# EAGLE design piezo-preamp-alex-rice-FETS v3 (EAGLE 7.2.0)
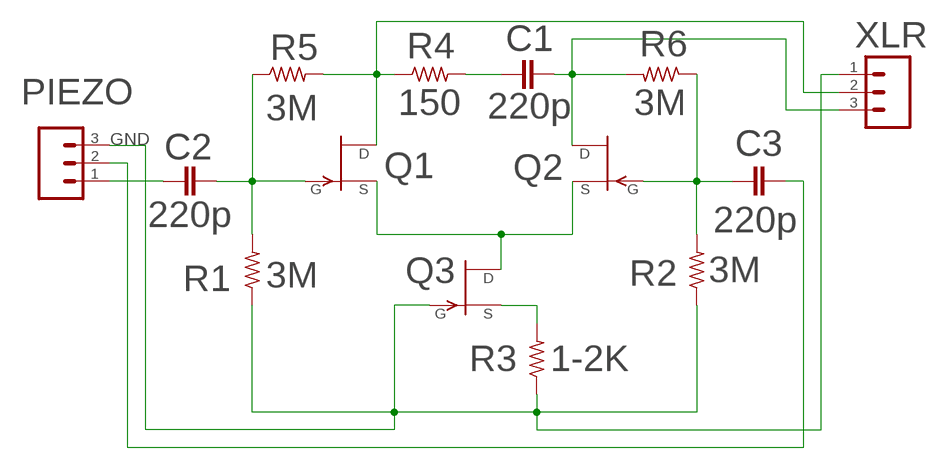
[diagram p0: schematic, sheet 1]

## Parts
C1  220p  C-EU050-030X075  [C050-030X075]
C2  220p  C-EU050-030X075  [C050-030X075]
C3  220p  C-EU050-030X075  [C050-030X075]
PIEZO  M03LOCK  [1X03_LOCK]
Q1  2N3819  2N3819-WIDETO92_WIDE  [TO92]
Q2  2N3819-WIDETO92_WIDE  [TO92]
Q3  2N3819-WIDETO92_WIDE  [TO92]
R1  3M  R-US_0204/5  [0204/5]
R2  3M  R-US_0204/5  [0204/5]
R3  1-2K  R-US_0204/5  [0204/5]
R4  150  R-US_0204/5  [0204/5]
R5  3M  R-US_0204/5  [0204/5]
R6  3M  R-US_0204/5  [0204/5]
XLR  M03LOCK  [1X03_LOCK]

## Nets
GND: PIEZO.3 Q3.2(G) R1.1 R2.1 R3.1 XLR.1
N$1: Q1.1(D) R4.1 R5.2 XLR.2
N$2: C1.2 Q2.1(D) R6.2 XLR.3
N$3: C1.1 R4.2
N$4: C3.1 Q2.2(G) R2.2 R6.1
N$5: C2.2 Q1.2(G) R1.2 R5.1
N$8: Q3.3(S) R3.2
N$10: C2.1 PIEZO.1
N$11: Q1.3(S) Q2.3(S) Q3.1(D)
N$12: C3.2 PIEZO.2

## Library data of the parts
C1-C3 = rcl:C-EU: CAPACITOR, European symbol
PIEZO = SparkFun-Connectors:M03: Header 3 Standard 3-pin 0.1" header. Use with straight break away headers (SKU : PRT-00116), right angle break away headers (PRT-00553), swiss pins (PRT-00743), machine pins (PRT-00117), and female headers (PRT-00115). Molex polarized connector foot print use with SKU : PRT-08232 with associated crimp pins and housings.; GND: GND
Q1-Q3 = T092_wide:2N3819-WIDE: N-Channel Junction FET
R1-R3 R5 R6 = rcl:R-US_: RESISTOR, American symbol
R4 = resistor:R-US_: RESISTOR, American symbol
XLR = SparkFun-Connectors:M03: Header 3 Standard 3-pin 0.1" header. Use with straight break away headers (SKU : PRT-00116), right angle break away headers (PRT-00553), swiss pins (PRT-00743), machine pins (PRT-00117), and female headers (PRT-00115). Molex polarized connector foot print use with SKU : PRT-08232 with associated crimp pins and housings.

## Board
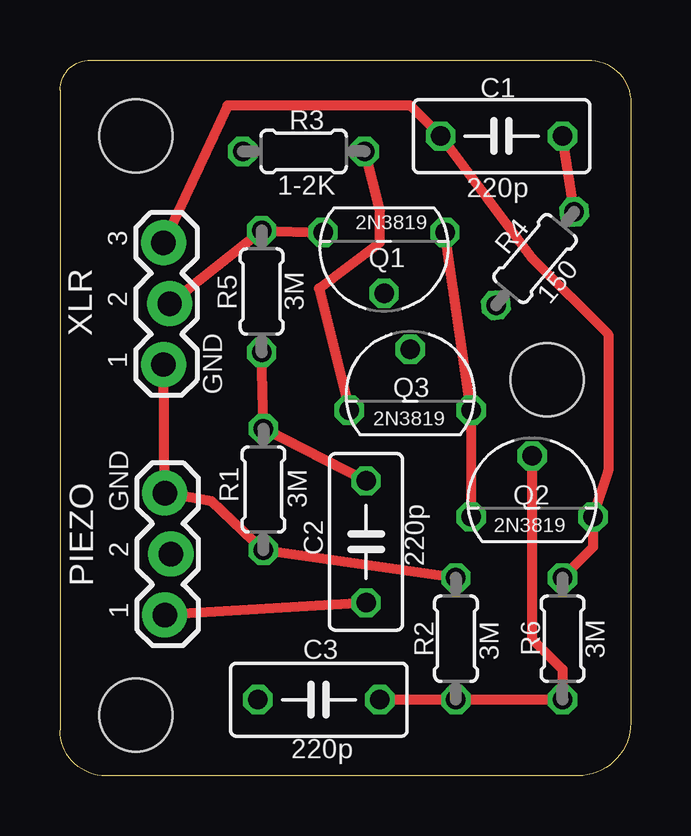
[diagram p1: board, top side]
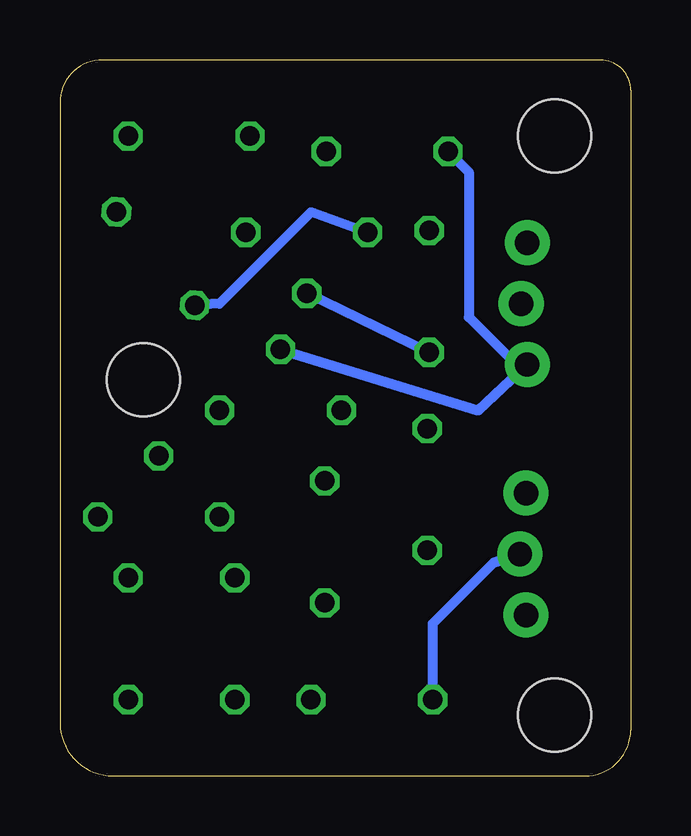
[diagram p2: board, bottom side, seen from below]

Size 23.8 x 29.84 mm. Coordinates in mm from the lower left corner, seen from the top.
Outline: 0,28.57 0,1.91 arc90 1.91,0 21.59,0 arc90 23.8,2.21 23.8,28.07 arc90 22.02,29.84 1.27,29.84 arc90 0,28.57
Copper layers (1*16): Top 0.0356mm / dielectric 1.5011mm / Bottom 0.0356mm
Design rules "default": minimum track width 6mil, minimum drill 13mil, track to track 6mil, track to pad 6mil, pad to pad 6mil, via to via 6mil, smd to smd 6mil, copper to edge 15mil, drill to drill 6mil, minimum pad ring 7mil, minimum via ring 7mil, stop-mask expansion 4mil, vias tented up to drill 0mil, thermal gap 10mil
Holes 3.05 mm at 3.17,2.54 3.17,26.67 20.32,16.51

### Footprints (pad centres in the part's own frame; a part is rotated, then mirrored left to right if it is on the bottom)
C050-030X075 = drill 0.813 octagon: 1 -2.54,0; 2 2.54,0
1X03_LOCK = drill 1.016 pad 1.88: 1 0,0.127; 2 2.54,-0.127; 3 5.08,0.127
TO92 = drill 0.813 octagon: 1 2.54,-0.635; 2 0,1.905; 3 -2.54,-0.635
0204/5 = drill 0.813 octagon: 1 -2.54,0; 2 2.54,0

### Placement (x,y rotation side)
C1  18.41,26.67 180 top
C2  12.76,9.75 90 top
C3  10.79,3.17 180 top
PIEZO  4.5,6.71 90 top
Q1  13.51,22.02 180 top
Q2  19.68,11.43 0 top
Q3  14.61,15.88 0 top
R1  8.48,11.94 90 top
R2  16.51,5.71 270 top
R3  10.16,26.04 0 top
R4  19.81,21.56 50 top
R5  8.41,20.19 90 top
R6  20.95,5.71 90 top
XLR  4.45,17.14 90 top

### Tracks (layer width: path | path; a pad name or v marks a point on that pad's centre or on a via)
GND
  Top 0.406: R2.1 R1.1 6.35,11.43 PIEZO.3 XLR.1
  Bottom 0.406: Q3.2 6.35,15.24 XLR.1 4.78,17.14 6.76,19.13 6.76,25.17 R3.1
N$1
  Top 0.406: XLR.2 R5.2 Q1.1
  Bottom 0.406: Q1.1 13.34,23.5 17.14,19.68 R4.1
N$2
  Top 0.406: R6.2 22.23,9.53 Q2.1 22.86,12.7 22.86,18.41 19.68,21.59 C1.2 14.61,27.94 6.99,27.94 XLR.3
N$3
  Top 0.406: R4.2 C1.1
N$4
  Top 0.406: C3.1 R2.2 R6.1 20.95,4.45 19.68,5.71 Q2.2
N$5
  Top 0.406: R5.1 R1.2 C2.2
  Bottom 0.406: R5.1 Q1.2
N$8
  Top 0.406: R3.2 13.34,23.5 13.34,22.23 10.79,20.32 Q3.3
N$10
  Top 0.406: C2.1 PIEZO.1
N$11
  Top 0.406: Q2.3 Q3.1 Q1.3
N$12
  Bottom 0.406: C3.2 8.26,6.35 5.71,8.89 PIEZO.2